# Altium schematic sheet USB HUB V1.2.SchDoc
size A4
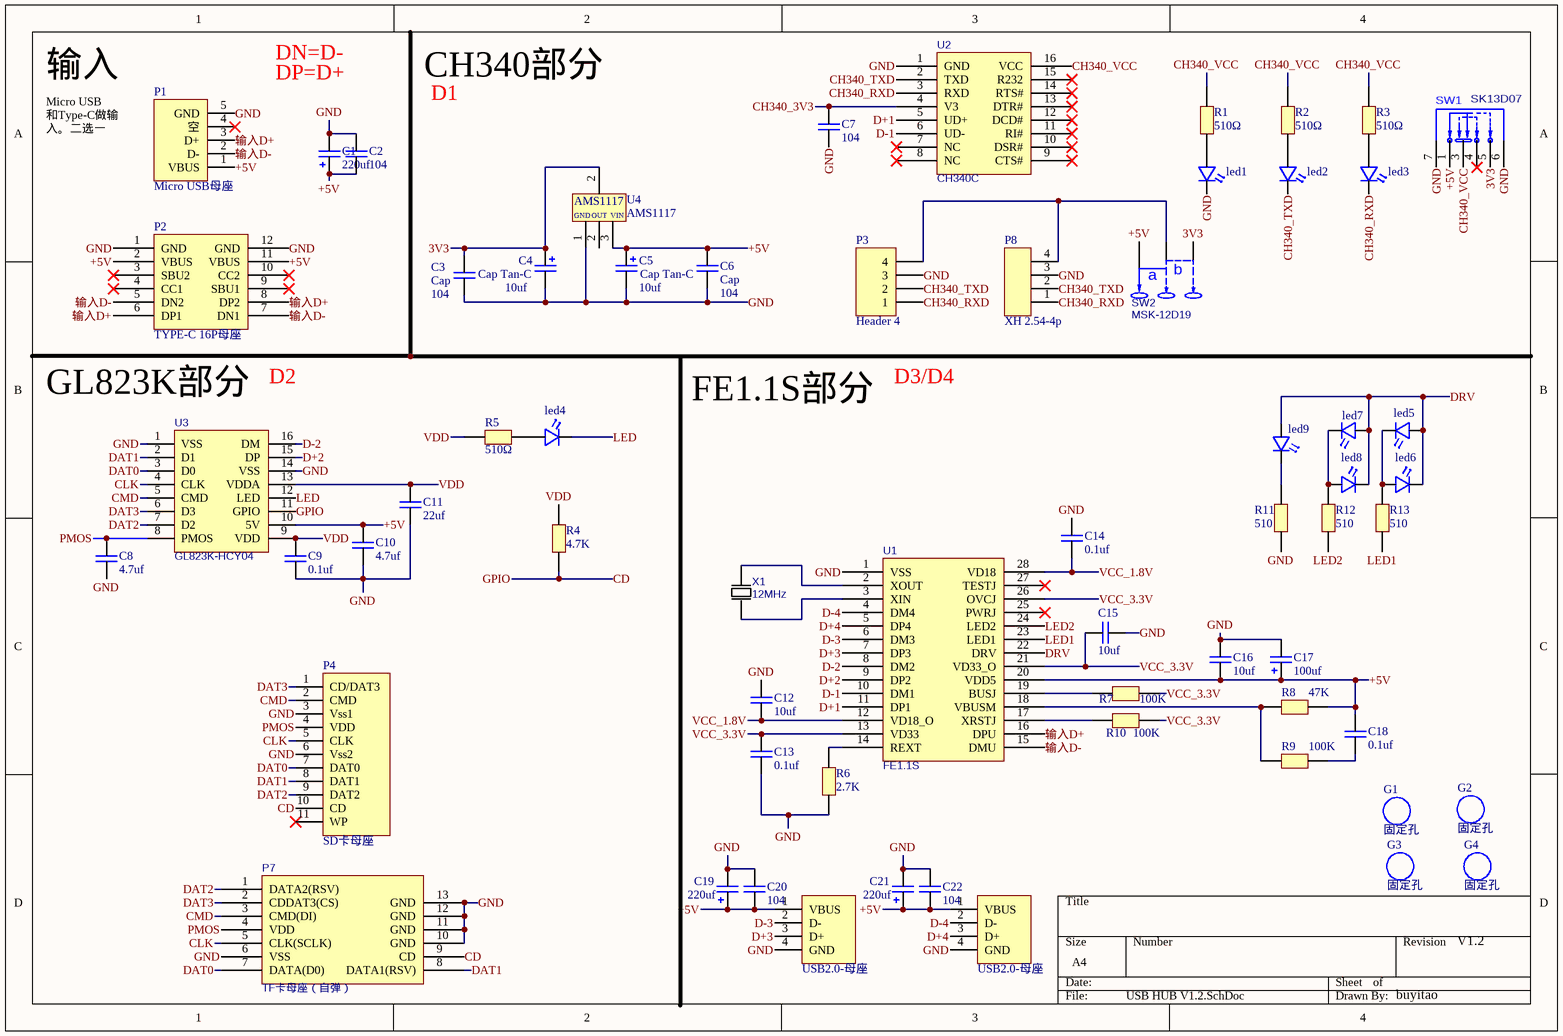
[diagram p0: USB HUB V1.2.SchDoc]

## Parts
C1  220uf  [CAP-SMD_BD6.3-L6.6-W6.6-FD]
C2  104  [Cap 0805]
C3  Cap  value 104  [Cap 0805]
C4  Cap Tan-C  value 10uf  [Cap tan-c]
C5  Cap Tan-C  value 10uf  [Cap tan-c]
C6  Cap  value 104  [Cap 0805]
C7  104  [Cap 0805]
C8  4.7uf  [Cap 0805]
C9  0.1uf  [Cap 0805]
C10  4.7uf  [Cap 0805]
C11  22uf  [Cap 0805]
C12  10uf  [Cap 0805]
C13  0.1uf  [Cap 0805]
C14  0.1uf  [Cap 0805]
C15  10uf  [Cap 0805]
C16  10uf  [Cap 0805]
C17  100uf  [CAP-SMD_BD6.3-L6.6-W6.6-FD]
C18  0.1uf  [Cap 0805]
C19  220uf  [CAP-SMD_BD6.3-L6.6-W6.6-FD]
C20  104  [Cap 0805]
C21  220uf  [CAP-SMD_BD6.3-L6.6-W6.6-FD]
C22  104  [Cap 0805]
G1  固定孔  [固定孔（M3）]
G2  固定孔  [固定孔（M3）]
G3  固定孔  [固定孔（M3）]
G4  固定孔  [固定孔（M3）]
led1  led  [led 0805]  (value not drawn)
led2  led  [led 0805]  (value not drawn)
led3  led  [led 0805]  (value not drawn)
led4  led  [led 0805 2号]  (value not drawn)
led5  led  [led 0805 2号]  (value not drawn)
led6  led  [led 0805 2号]  (value not drawn)
led7  led  [led 0805 2号]  (value not drawn)
led8  led  [led 0805 2号]  (value not drawn)
led9  led  [led 0805 2号]  (value not drawn)
P1  Micro USB母座  [Micro USB母座（沉板0.8带卷边四脚）]
P2  TYPE-C 16P母座  [TYPEC 16P（1.6沉板）]
P3  Header 4  [HDR1X4]
P4  SD卡母座  [SD卡母座（短）]
P5  USB2.0-母座  [USB2.0母座弯脚卷边带后盖]
P6  USB2.0-母座  [USB2.0母座弯脚卷边带后盖]
P7  TF卡母座（自弹）  [TF卡母座（自弹）]
P8  XH 2.54-4p  [XH 2.54-4P]
R1  510Ω  [R 0805]
R2  510Ω  [R 0805]
R3  510Ω  [R 0805]
R4  4.7K  [R 0805]
R5  510Ω  [R 0805]
R6  2.7K  [R 0805]
R7  100K  [R 0805]
R8  47K  [R 0805]
R9  100K  [R 0805]
R10  100K  [R 0805]
R11  510  [R 0805]
R12  510  [R 0805]
R13  510  [R 0805]
SW1  SK13D07  [SK13D07]
SW2  MSK-12D19  [MSK-12D19]
U1  FE1.1S  [SSOP-28_150MIL]
U2  CH340C  [SOP-16_150MIL]
U3  GL823K-HCY04  [SSOP-16_150MIL]
U4  AMS1117  [ams1117]
X1  12MHz  [HC-49S_L11.4-W4.8]

## Nets
3V3: C3.1 C4.1 SW1.5 SW2.3 U4.2
+5V: C1.1 C2.1 C5.1 C6.2 C10.1 C16.1 C17.1 C18.2 C19.1 C20.1 C21.1 C22.1 P1.1(VBUS) P2.2(VBUS) P2.11(VBUS) P5.1(VBUS) P6.1(VBUS) R8.2 SW1.1 SW2.1 U1.20(VDD5) U3.10(5V) U4.3
CD: P4.10(CD) P7.9(CD) R4.1 U3.11(GPIO)  [also labelled GPIO]
CH340_3V3: C7.2 U2.4(V3)
CH340_RXD: led3.2 P3.1 P8.1 U2.3(RXD)
CH340_TXD: led2.2 P3.2 P8.2 U2.2(TXD)
CH340_VCC: R1.2 R2.2 R3.2 SW1.3 U2.16(VCC)
CLK: P4.5(CLK) P7.5(CLK(SCLK)) U3.4(CLK)
CMD: P4.2(CMD) P7.3(CMD(DI)) U3.5(CMD)
D+1: U1.11(DP1) U2.5(UD+)
D+2: U1.9(DP2) U3.15(DP)
D+3: P5.3(D+) U1.7(DP3)
D+4: P6.3(D+) U1.5(DP4)
D-1: U1.10(DM1) U2.6(UD-)
D-2: U1.8(DM2) U3.16(DM)
D-3: P5.2(D-) U1.6(DM3)
D-4: P6.2(D-) U1.4(DM4)
DAT0: P4.7(DAT0) P7.7(DATA(D0)) U3.3(D0)
DAT1: P4.8(DAT1) P7.8(DATA1(RSV)) U3.2(D1)
DAT2: P4.9(DAT2) P7.1(DATA2(RSV)) U3.7(D2)
DAT3: P4.1(CD/DAT3) P7.2(CDDAT3(CS)) U3.6(D3)
DRV: led5.1 led6.2 led7.1 led8.2 led9.1 U1.22(DRV)
GND: C1.2 C2.2 C3.2 C4.2 C5.2 C6.1 C7.1 C8.2 C9.2 C10.2 C11.2 C12.1 C13.2 C14.2 C15.2 C16.2 C17.2 C19.2 C20.2 C21.2 C22.2 led1.2 P1.5(GND) P2.1(GND) P2.12(GND) P3.3 P4.3(Vss1) P4.6(Vss2) P5.4(GND) P6.4(GND) P7.6(VSS) P7.10(GND) P7.11(GND) P7.12(GND) P7.13(GND) P8.3 R6.1 R11.1 SW1.6 SW1.7 U1.1(VSS) U2.1(GND) U3.1(VSS) U3.14(VSS) U4.1
LED: led4.2 U3.12(LED)
LED1: R13.1 U1.23(LED1)
LED2: R12.1 U1.24(LED2)
PMOS: C8.1 P4.4(VDD) P7.4(VDD) U3.8(PMOS)
VCC_1.8V: C12.2 C14.1 U1.12(VD18_O) U1.28(VD18)
VCC_3.3V: C13.1 C15.1 R7.2 R10.2 U1.13(VD33) U1.21(VD33_O) U1.26(OVCJ)
VDD: C9.1 C11.1 R4.2 R5.1 U3.9(VDD) U3.13(VDDA)
输入D+: P1.3(D+) P2.6(DP1) P2.8(DP2) U1.16(DPU)
输入D-: P1.2(D-) P2.5(DN2) P2.7(DN1) U1.15(DMU)
NetC18_1: C18.1 R9.2
Netled1_1: led1.1 R1.1
Netled2_1: led2.1 R2.1
Netled3_1: led3.1 R3.1
Netled4_1: led4.1 R5.2
Netled5_2: led5.2 led6.1 R13.2
Netled7_2: led7.2 led8.1 R12.2
Netled9_2: led9.2 R11.2
NetP3_4: P3.4 P8.4 SW2.2
NetR6_2: R6.2 U1.14(REXT)
NetR7_1: R7.1 U1.19(BUSJ)
NetR8_1: R8.1 R9.1 U1.18(VBUSM)
NetR10_1: R10.1 U1.17(XRSTJ)
NetU1_2: U1.2(XOUT) X1.2(OSC2)
NetU1_3: U1.3(XIN) X1.1(OSC1)

Not connected (* = marked no-connect by the designer): P1 4(空)*; P2 3(SBU2)* 4(CC1)* 9(SBU1)* 10(CC2)*; P4 11(WP)*; SW1 4*; U1 25(PWRJ)* 27(TESTJ)*; U2 7(NC)* 8(NC)* 9(CTS#)* 10(DSR#)* 11(RI#)* 12(DCD#)* 13(DTR#)* 14(RTS#)* 15(R232)*

## Notes on the sheet
- 输入
- DN=D-
- DP=D+
- CH340部分
- D1
- Micro USB
  和Type-C做输入。二选一
- D2
- D3/D4
- GL823K部分
- FE1.1S部分
- V1.2
- buyitao
- (in symbol 12D19) a; b
- (in symbol AMS1117) GND; OUT; VIN

## Library data of the parts
C1 C17 C19 C21 = pcap
C2 C7-C16 C18 C20 C22 = Cap
P3 = Header 4: Header, 4-Pin; LatestRevisionDate: 17-Jul-2002; LatestRevisionNote: Re-released for DXP Platform.; Publisher: Altium Limited
P7 = TF卡母座（自弹）: BOM_Manufacturer: HRO; BOM_Manufacturer Part: TF-01A; BOM_Supplier: LCSC; BOM_Supplier Part: C91145; spicePre: C
R1-R13 = Res
SW2 = 12D19: BOM_Manufacturer: HRO; BOM_Manufacturer Part: K3-1260D-L1; BOM_Supplier: LCSC; BOM_Supplier Part: C92657; spicePre: S; spiceSymbolName: K3-1260D-L1
U1 = FE1.1S: BOM_Manufacturer: TERMINUS; BOM_Supplier: LCSC; BOM_Manufacturer Part: FE1.1S; image: //image.lceda.cn/szlcsc/C9359.jpg; BOM_Supplier Part: C9359; spicePre: U
U2 = CH340C: BOM_Manufacturer: WCH; BOM_Supplier: LCSC; BOM_Manufacturer Part: CH340C; BOM_Supplier Part: C84681; spicePre: U
U3 = GL823K-HCY04: BOM_Manufacturer: Genesys Logic; Contributor: LCSC; BOM_Supplier: LCSC; BOM_Supplier Part: C284879; BOM_Manufacturer Part: GL823K-HCY04; spicePre: U
X1 = 8MHz: BOM_Manufacturer: ZheJiang East Crystal Elec; BOM_Manufacturer Part: C08000J060; nameAlias: Frequency; Contributor: LCSC; BOM_Supplier: LCSC; BOM_Supplier Part: C259040; spicePre: X; spiceSymbolName: C08000J060